# Altium schematic sheet MGD.SCH2.SchDoc
size E
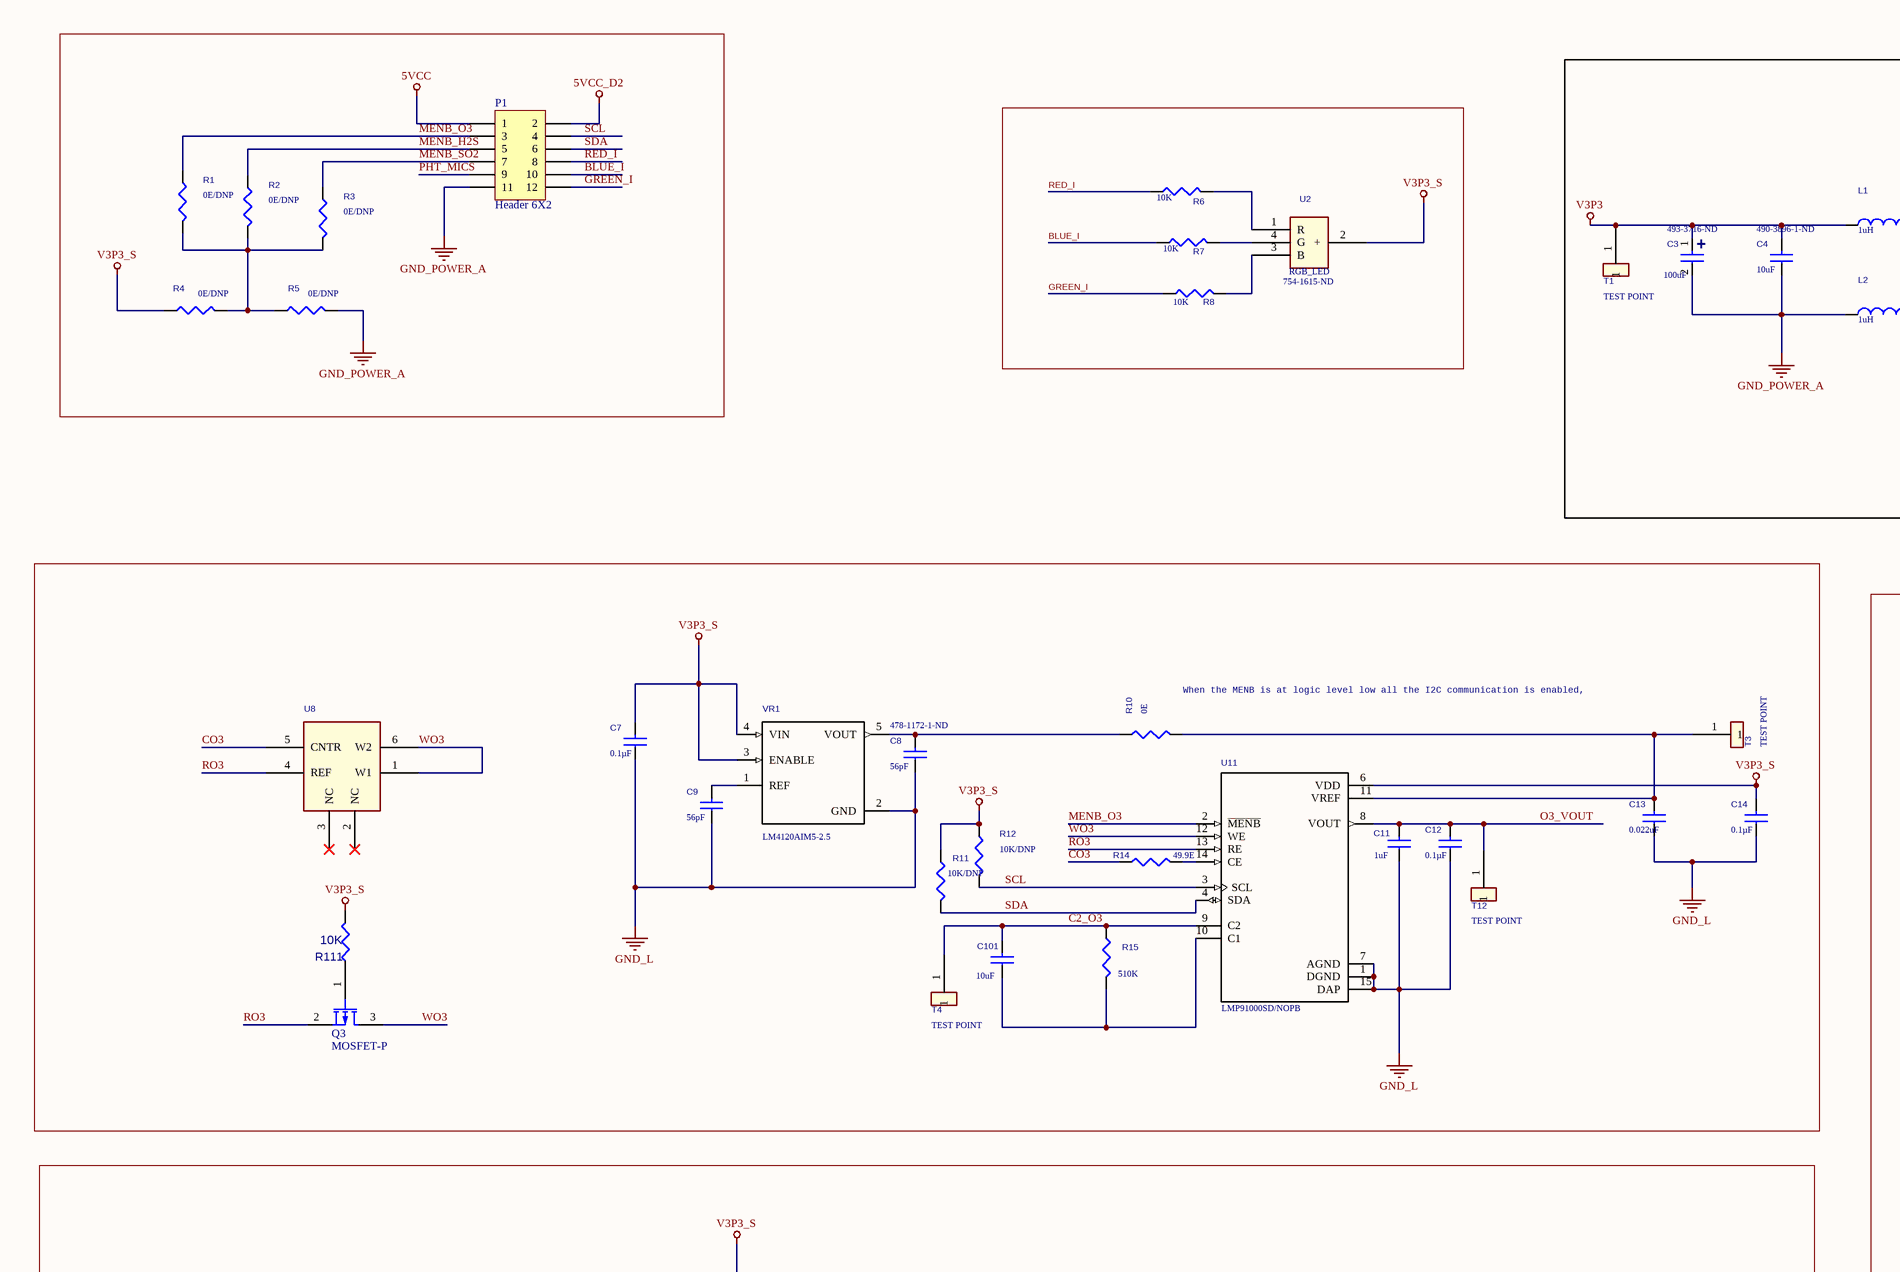
[diagram p0: MGD.SCH2.SchDoc, top left]
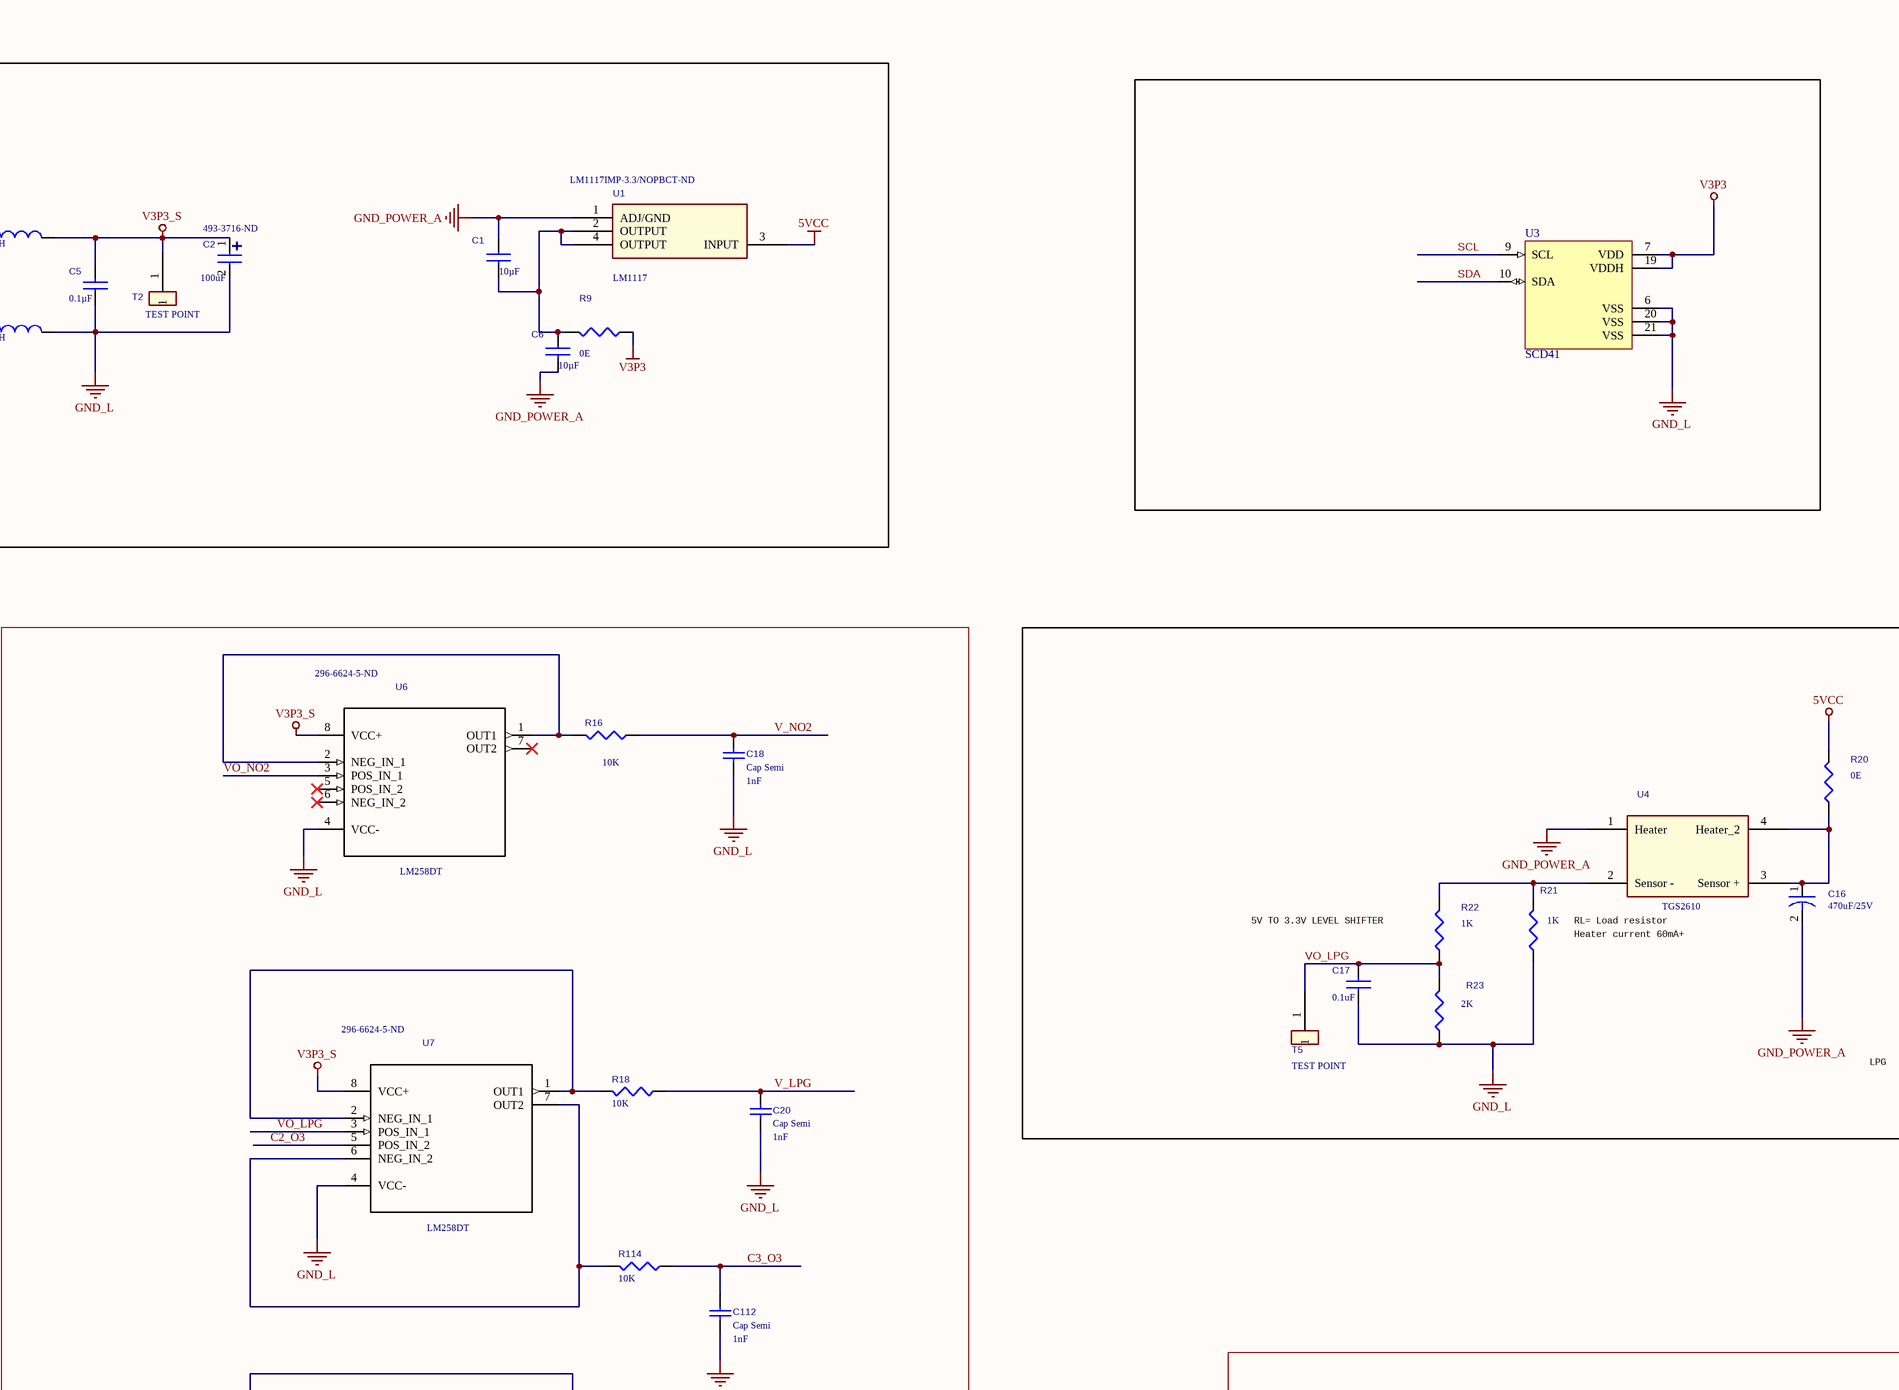
[diagram p1: MGD.SCH2.SchDoc, top middle]
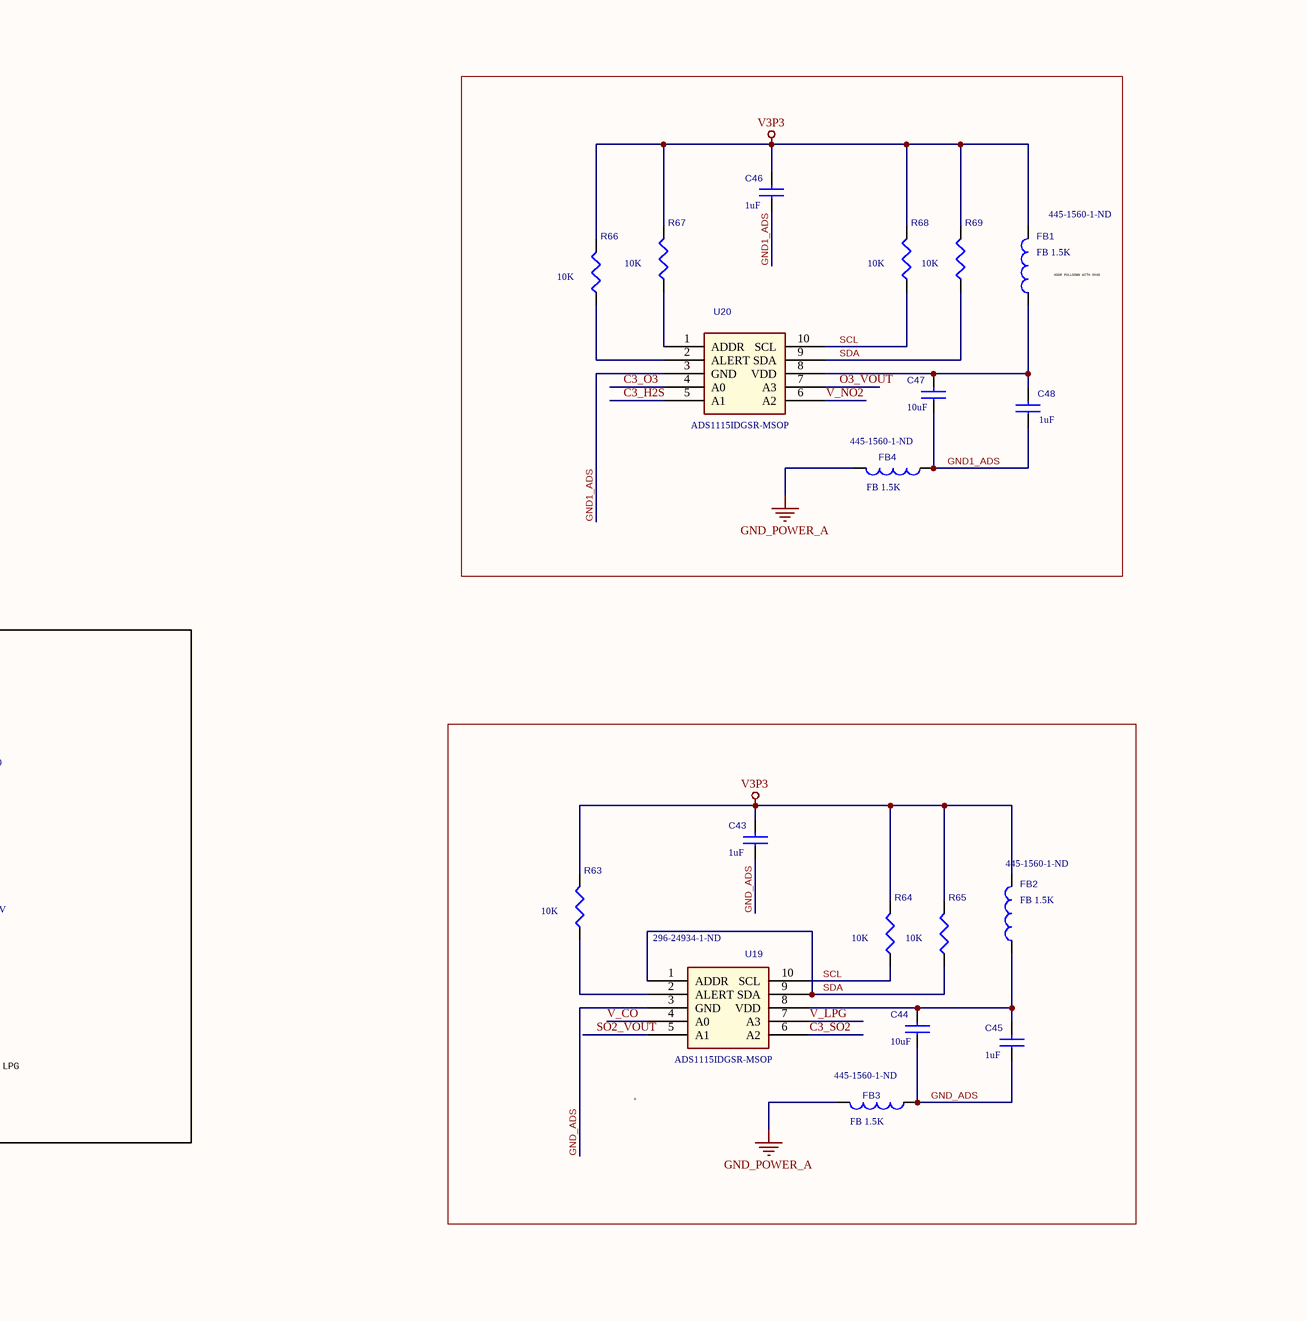
[diagram p2: MGD.SCH2.SchDoc, top right]
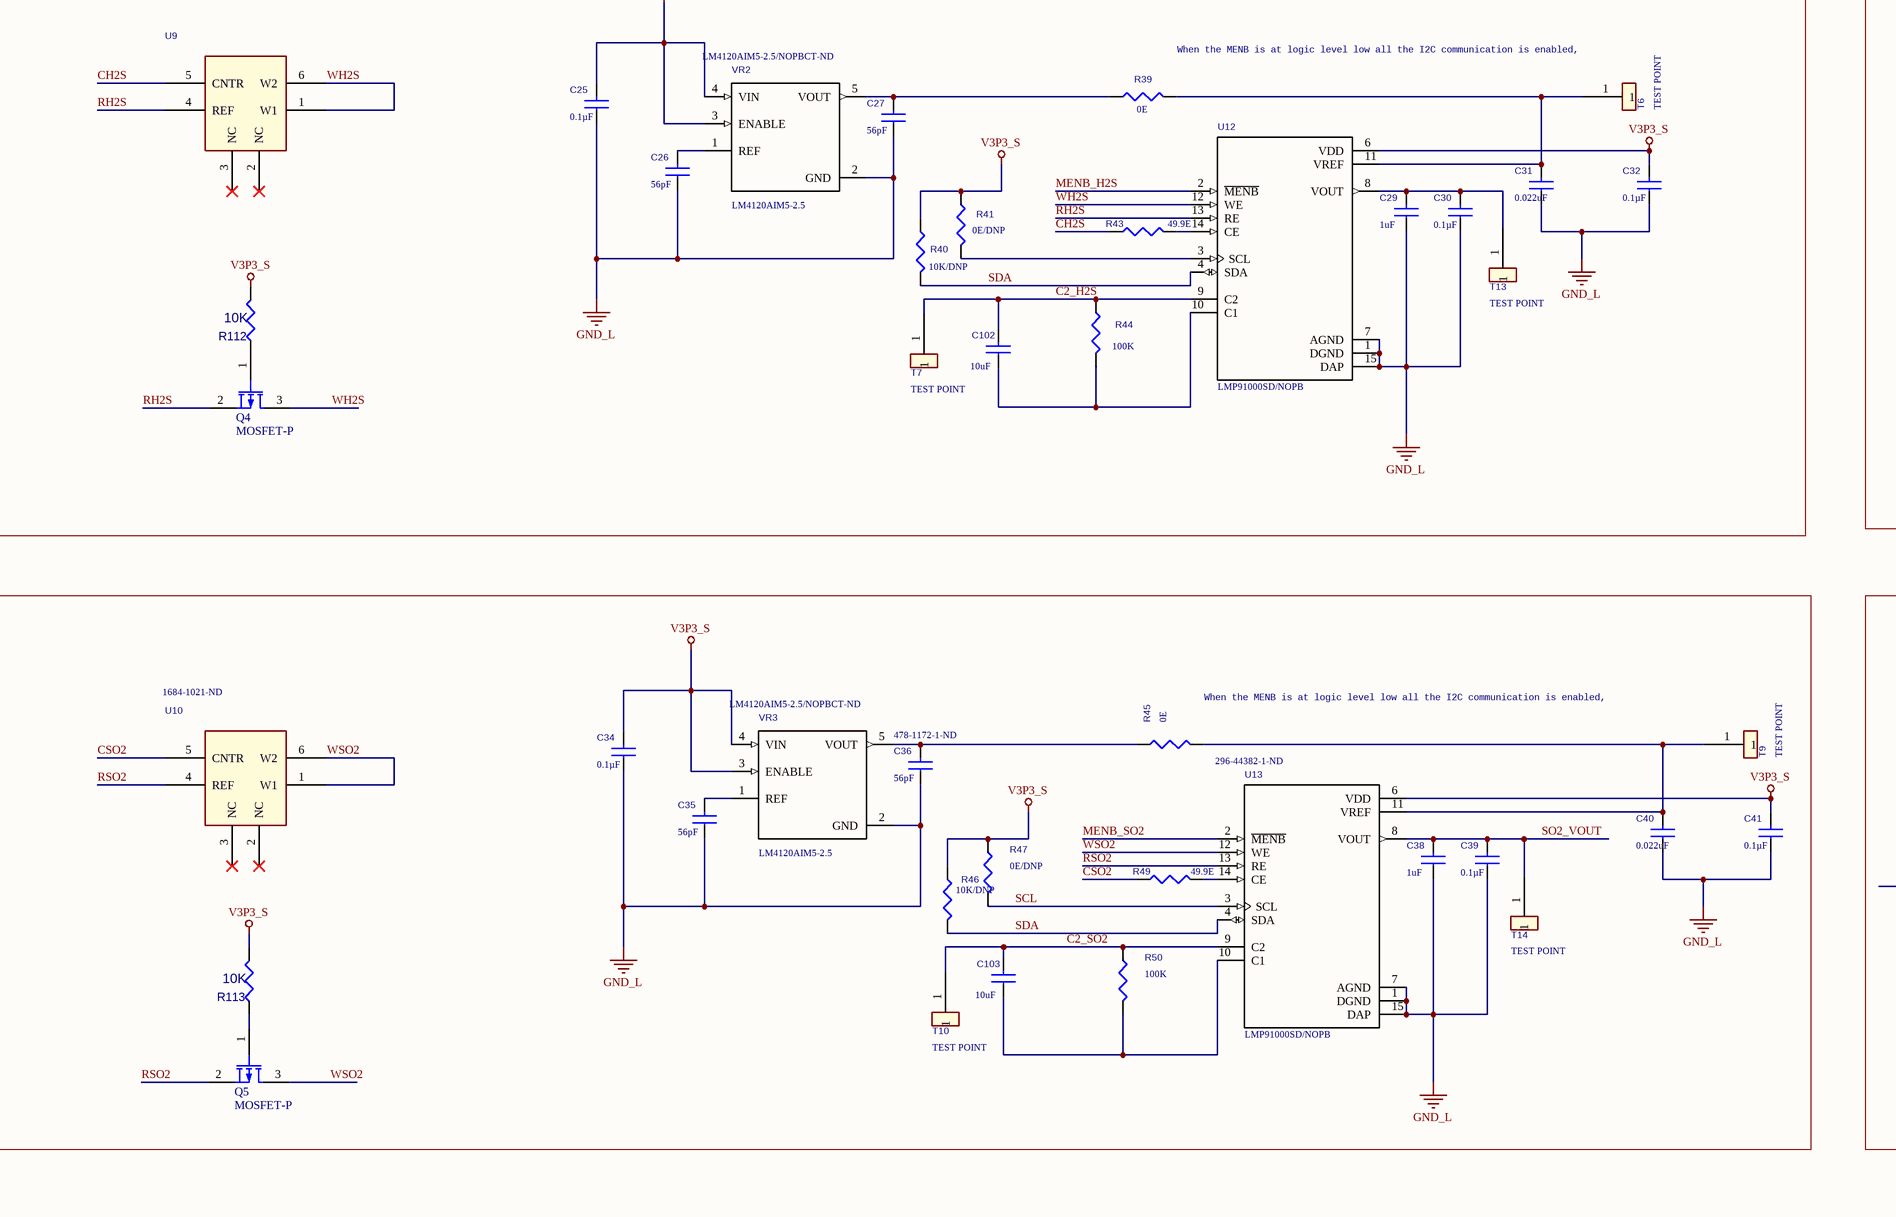
[diagram p3: MGD.SCH2.SchDoc, bottom left]
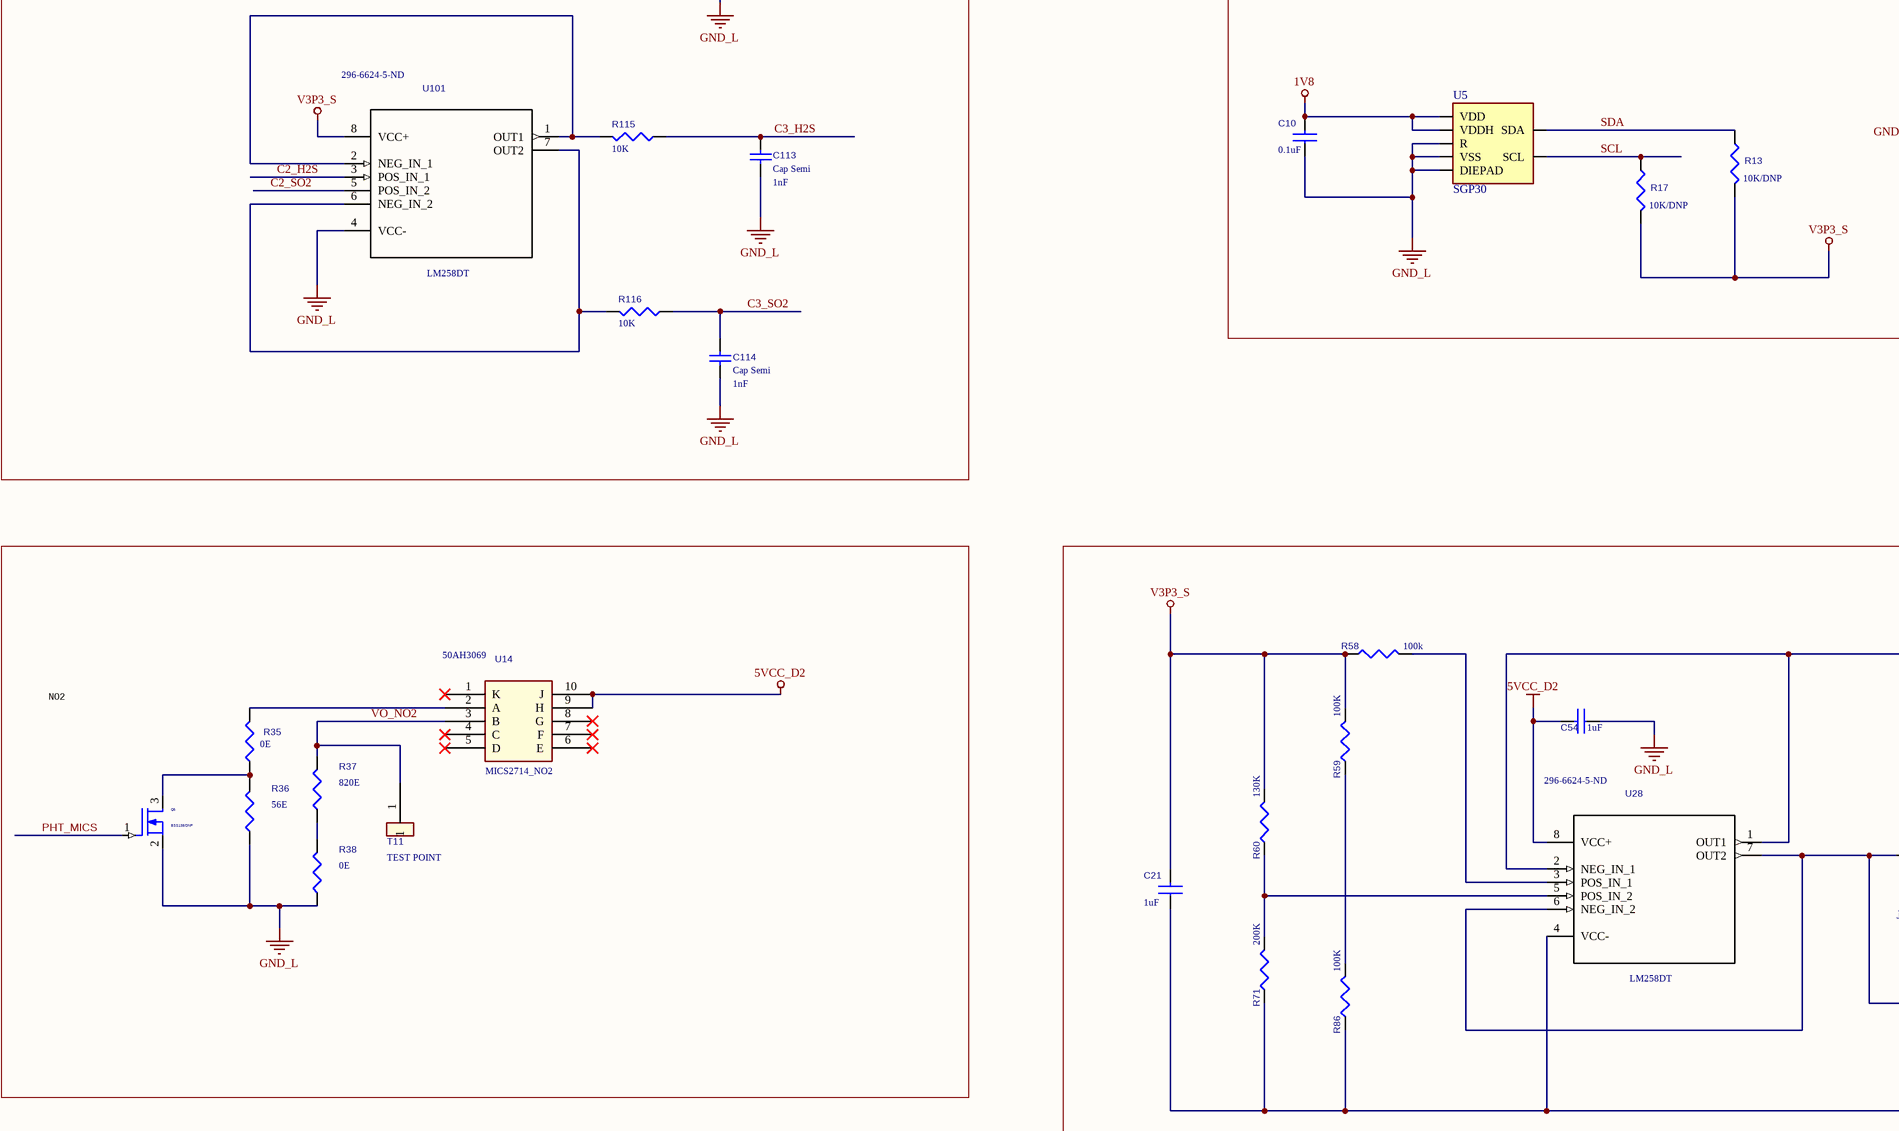
[diagram p4: MGD.SCH2.SchDoc, bottom middle]
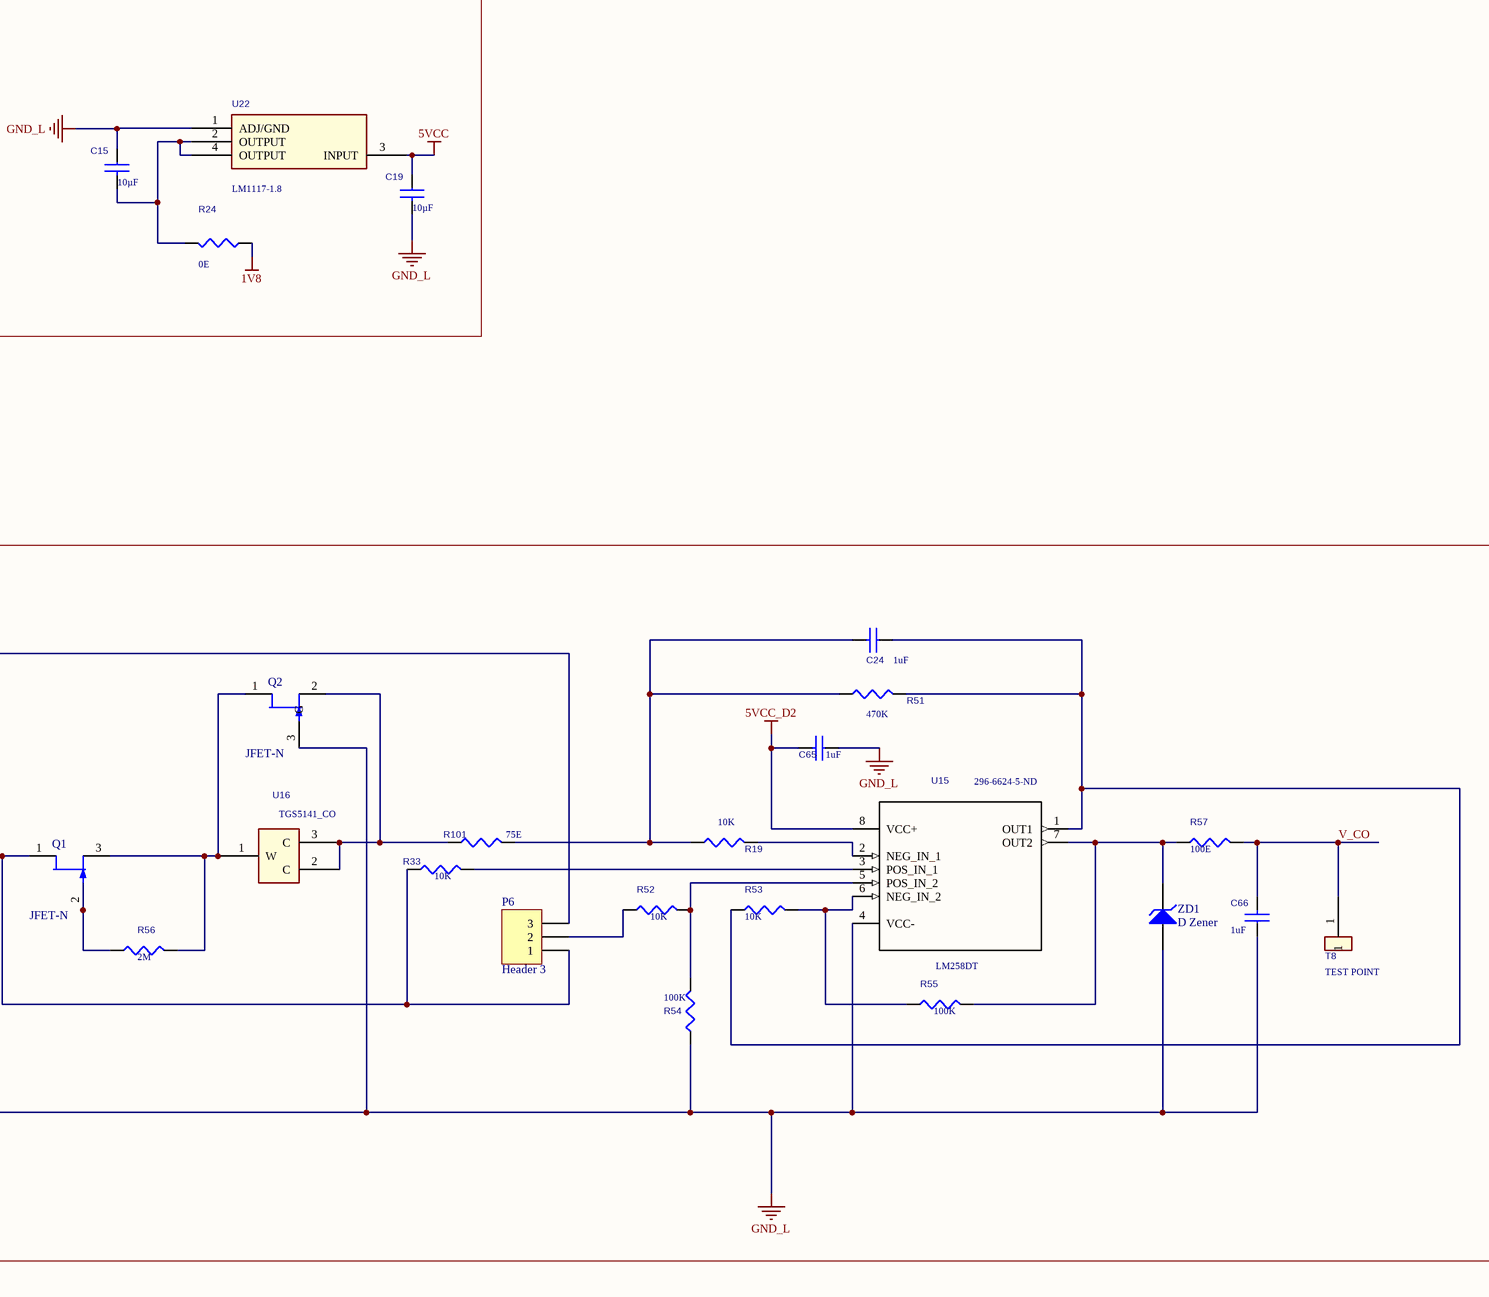
[diagram p5: MGD.SCH2.SchDoc, bottom right]

## Parts
C1  10µF  [C0603]
C2  100uF  Supplier Part Number 1: 493-3716-ND  [C1206]
C3  100uF  Supplier Part Number 1: 493-3716-ND  [C1206]
C4  10uF  Supplier Part Number 1: 490-3896-1-ND  [C0603]
C5  0.1µF  [C0603]
C6  10µF  [C0603]
C7  0.1µF  [C0603]
C8  56pF  Supplier Part Number 1: 478-1172-1-ND  [C0603]
C9  56pF  [C0603]
C10  0.1uF  [C0603]
C11  1uF  [C0603]
C12  0.1µF  [C0603]
C13  0.022uF  [C0603]
C14  0.1µF  [C0603]
C15  10µF  [C0603]
C16  470uF/25V  [C16, C49, C58]
C17  0.1uF  [C0603]
C18  Cap Semi  value 1nF  [C0603]
C19  10µF  [C0603]
C20  Cap Semi  value 1nF  [C0603]
C21  1uF  [C0603]
C24  1uF  [C0603]
C25  0.1µF  [C0603]
C26  56pF  [C0603]
C27  56pF  [C0603]
C29  1uF  [C0603]
C30  0.1µF  [C0603]
C31  0.022uF  [C0603]
C32  0.1µF  [C0603]
C34  0.1µF  [C0603]
C35  56pF  [C0603]
C36  56pF  Supplier Part Number 1: 478-1172-1-ND  [C0603]
C38  1uF  [C0603]
C39  0.1µF  [C0603]
C40  0.022uF  [C0603]
C41  0.1µF  [C0603]
C43  1uF  [C0603]
C44  10uF  [C0603]
C45  1uF  [C0603]
C46  1uF  [C0603]
C47  10uF  [C0603]
C48  1uF  [C0603]
C54  1uF  [C0603]
C65  1uF  [C0603]
C66  1uF  [C0603]
C101  10uF  [C0603]
C102  10uF  [C0603]
C103  10uF  [C0603]
C112  Cap Semi  value 1nF  [C0603]
C113  Cap Semi  value 1nF  [C0603]
C114  Cap Semi  value 1nF  [C0603]
FB1  FB 1.5K  Supplier Part Number 1: 445-1560-1-ND  [FB1, FB2, FB3, FB4]
FB2  FB 1.5K  Supplier Part Number 1: 445-1560-1-ND  [FB1, FB2, FB3, FB4]
FB3  FB 1.5K  Supplier Part Number 1: 445-1560-1-ND  [FB1, FB2, FB3, FB4]
FB4  FB 1.5K  Supplier Part Number 1: 445-1560-1-ND  [FB1, FB2, FB3, FB4]
L1  1uH  [L3, L4, L5, L6, L7]
L2  1uH  [L3, L4, L5, L6, L7]
P1  Header 6X2  [P1,P3_Updated]
P6  Header 3  [P6]
Q1  JFET-N  [Q1-Q2]
Q2  JFET-N  [SOT23F]
Q3  MOSFET-P  [Q3-Q5,Q6]
Q4  MOSFET-P  [Q3-Q5,Q6]
Q5  MOSFET-P  [Q3-Q5,Q6]
Q6  BSS138/DNP  [Q3-Q5,Q6]
R1  0E/DNP  [R0603]
R2  0E/DNP  [R0603]
R3  0E/DNP  [R0603]
R4  0E/DNP  [R0603]
R5  0E/DNP  [R0603]
R6  10K  [R0603]
R7  10K  [R0603]
R8  10K  [R0603]
R9  0E  [R0603]
R10  0E  [R0603]
R11  10K/DNP  [R0603]
R12  10K/DNP  [R0603]
R13  10K/DNP  [R0603]
R14  49.9E  [R0603]
R15  510K  [R0603]
R16  10K  [R0603]
R17  10K/DNP  [R0603]
R18  10K  [R0603]
R19  10K  [R0603]
R20  0E  [R0603]
R21  1K  [R0603]
R22  1K  [R0603]
R23  2K  [R0603]
R24  0E  [R0603]
R33  10K  [R0603]
R35  0E  [R0603]
R36  56E  [R0603]
R37  820E  [R0603]
R38  0E  [R0603]
R39  0E  [R0603]
R40  10K/DNP  [R0603]
R41  0E/DNP  [R0603]
R43  49.9E  [R0603]
R44  100K  [R0603]
R45  0E  [R0603]
R46  10K/DNP  [R0603]
R47  0E/DNP  [R0603]
R49  49.9E  [R0603]
R50  100K  [R0603]
R51  470K  [R0603]
R52  10K  [R0603]
R53  10K  [R0603]
R54  100K  [R0603]
R55  100K  [R0603]
R56  2M  [R0603]
R57  100E  [R0603]
R58  100k  [R0603]
R59  100K  [R0603]
R60  130K  [R0603]
R63  10K  [R0603]
R64  10K  [R0603]
R65  10K  [R0603]
R66  10K  [R0603]
R67  10K  [R0603]
R68  10K  [R0603]
R69  10K  [R0603]
R71  200K  [R0603]
R86  100K  [R0603]
R101  75E  [R0603]
R111  10K  [R0603]
R112  10K  [R0603]
R113  10K  [R0603]
R114  10K  [R0603]
R115  10K  [R0603]
R116  10K  [R0603]
T1  TEST POINT  [TP]
T2  TEST POINT  [TP]
T3  TEST POINT  [TP]
T4  TEST POINT  [TP]
T5  TEST POINT  [TP]
T6  TEST POINT  [TP]
T7  TEST POINT  [TP]
T8  TEST POINT  [TP]
T9  TEST POINT  [TP]
T10  TEST POINT  [TP]
T11  TEST POINT  [TP]
T12  TEST POINT  [TP]
T13  TEST POINT  [TP]
T14  TEST POINT  [TP]
U1  LM1117  Supplier Part Number 1: LM1117IMP-3.3/NOPBCT-ND  [U1, U24              SOT-223]
U2  RGB_LED  Supplier Part Number 1: 754-1615-ND  [U2]
U3  SCD41  [XDCR_SCD41-D-R2]
U4  TGS2610  [U4]
U5  SGP30  [XCDR_SGP40-D-R4]
U6  LM258DT  Supplier Part Number 1: 296-6624-5-ND  [U6, U8                    SOIC-8N]
U7  LM258DT  Supplier Part Number 1: 296-6624-5-ND  [U6, U8                    SOIC-8N]
U8  SPEC_SENS_PTH_SO2  [U3, U7, U11]  (value not drawn)
U9  SPEC_SENS_PTH_SO2  [U3, U7, U11]  (value not drawn)
U10  Supplier Part Number 1: 1684-1021-ND  [U3, U7, U11]  (hidden comment: SPEC_SENS_PTH_SO2)
U11  LMP91000SD/NOPB  [U5, U10, U13]
U12  LMP91000SD/NOPB  [U5, U10, U13]
U13  LMP91000SD/NOPB  Supplier Part Number 1: 296-44382-1-ND  [U5, U10, U13]
U14  MICS2714_NO2  Supplier Part Number 1: 50AH3069  [U12]
U15  LM258DT  Supplier Part Number 1: 296-6624-5-ND  [U6, U8                    SOIC-8N]
U16  TGS5141_CO  [U16]
U19  ADS1115IDGSR-MSOP  Supplier Part Number 1: 296-24934-1-ND  [U19, U20]
U20  ADS1115IDGSR-MSOP  [U19, U20]
U22  LM1117-1.8  [U1, U24              SOT-223]
U28  LM258DT  Supplier Part Number 1: 296-6624-5-ND  [U28]
U101  LM258DT  Supplier Part Number 1: 296-6624-5-ND  [U6, U8                    SOIC-8N]
VR1  LM4120AIM5-2.5  [VR1, VR2, VR3]
VR2  LM4120AIM5-2.5  Supplier Part Number 1: LM4120AIM5-2.5/NOPBCT-ND  [VR1, VR2, VR3]
VR3  LM4120AIM5-2.5  Supplier Part Number 1: LM4120AIM5-2.5/NOPBCT-ND  [VR1, VR2, VR3]
ZD1  D Zener  [ZD1]

## Blocks framed on the sheet
ADDR PULLDOWN WITH 0X48: C46-C48 FB1 FB4 R66-R69 U20
A: C43-C45 FB2 FB3 R63-R65 U19
NO2: Q6 R35-R38 T11 U14

## Nets
1V8: C10.2 R24.1 U5.1(VDD) U5.5(VDDH)
5VCC: C19.1 P1.1 R20.2 U1.3(INPUT) U22.3(INPUT)
5VCC_D2: C54.2 C65.2 P1.2 U14.9(H) U14.10(J) U15.8(VCC+) U28.8(VCC+)
GND_L: C2.2 C5.1 C7.1 C8.1 C9.1 C10.1 C11.1 C12.1 C13.1 C14.1 C15.1 C17.1 C18.1 C19.2 C20.1 C21.1 C25.1 C26.1 C27.1 C29.1 C30.1 C31.1 C32.1 C34.1 C35.1 C36.1 C38.1 C39.1 C40.1 C41.1 C54.1 C65.1 C66.1 C112.1 C113.1 C114.1 L2.2 Q2.3(G) Q6.2(SOURCE) R21.2 R23.1 R36.1 R38.1 R54.1 R71.1 R86.1 U3.6(VSS) U3.20(VSS) U3.21(VSS) U5.2(VSS) U5.4(R) U5.DIEPAD U6.4(VCC-) U7.4(VCC-) U11.1(DGND) U11.7(AGND) U11.15(DAP) U12.1(DGND) U12.7(AGND) U12.15(DAP) U13.1(DGND) U13.7(AGND) U13.15(DAP) U15.4(VCC-) U22.1(ADJ/GND) U28.4(VCC-) U101.4(VCC-) VR1.2(GND) VR2.2(GND) VR3.2(GND) ZD1.1(A)
GND_POWER_A: C1.1 C3.2 C4.1 C6.2 C16.2 FB3.2 FB4.2 L2.1 P1.11 R5.2 U1.1(ADJ/GND) U4.1(Heater)
V3P3: C3.1 C4.2 C43.2 C46.2 FB1.2 FB2.2 L1.1 R9.1 R63.1 R64.1 R65.1 R66.1 R67.1 R68.1 R69.1 T1.1 U3.7(VDD) U3.19(VDDH)
V3P3_S: C2.1 C5.2 C7.2 C14.2 C21.2 C25.2 C32.2 C34.2 C41.2 L1.2 R4.1 R11.1 R12.1 R13.2 R17.2 R40.1 R41.1 R46.1 R47.1 R58.1 R59.2 R60.2 R111.2 R112.2 R113.2 T2.1 U2.2(+) U6.8(VCC+) U7.8(VCC+) U11.6(VDD) U12.6(VDD) U13.6(VDD) U101.8(VCC+) VR1.3(ENABLE) VR1.4(VIN) VR2.3(ENABLE) VR2.4(VIN) VR3.3(ENABLE) VR3.4(VIN)
BLUE_I: P1.10 R7.1
C2_H2S: C102.2 R44.1 T7.1 U12.9(C2) U101.3(POS_IN_1)
C2_O3: C101.2 R15.1 T4.1 U7.5(POS_IN_2) U11.9(C2)
C2_SO2: C103.2 R50.1 T10.1 U13.9(C2) U101.5(POS_IN_2)
C3_H2S: C113.2 R115.1 U20.5(A1)
C3_O3: C112.2 R114.1 U20.4(A0)
C3_SO2: C114.2 R116.1 U19.6(A2)
CH2S: R43.1 U9.5(CNTR)
CO3: R14.1 U8.5(CNTR)
CSO2: R49.1 U10.5(CNTR)
GND1_ADS: C46.1 C47.1 C48.1 FB4.1 U20.3(GND)
GND_ADS: C43.1 C44.1 C45.1 FB3.1 U19.3(GND)
GREEN_I: P1.12 R8.1
MENB_H2S: P1.5 R2.1 U12.2(~{MENB})
MENB_O3: P1.3 R1.1 U11.2(~{MENB})
MENB_SO2: P1.7 R3.1 U13.2(~{MENB})
O3_VOUT: C11.2 C12.2 T12.1 U11.8(VOUT) U20.7(A3)
PHT_MICS: P1.9 Q6.1(GATE)
RED_I: P1.8 R6.1
RH2S: Q4.2(S) U9.4(REF) U12.13(RE)
RO3: Q3.2(S) U8.4(REF) U11.13(RE)
RSO2: Q5.2(S) U10.4(REF) U13.13(RE)
SCL: P1.4 R12.2 R17.1 R47.2 R64.2 R68.2 U3.9(SCL) U5.6(SCL) U11.3(SCL) U13.3(SCL) U19.10(SCL) U20.10(SCL)
SDA: P1.6 R11.2 R13.1 R40.2 R46.2 R65.2 R69.2 U3.10(SDA) U5.3(SDA) U11.4(SDA) U12.4(SDA) U13.4(SDA) U19.1(ADDR) U19.9(SDA) U20.9(SDA)
SO2_VOUT: C38.2 C39.2 T14.1 U13.8(VOUT) U19.5(A1)
V_CO: C66.2 R57.2 T8.1 U19.4(A0)
V_LPG: C20.2 R18.1 U19.7(A3)
V_NO2: C18.2 R16.1 U20.6(A2)
VO_LPG: C17.2 R22.1 R23.2 T5.1 U7.3(POS_IN_1)
VO_NO2: R37.2 T11.1 U6.3(POS_IN_1) U14.3(B)
WH2S: Q4.3(D) U9.1(W1) U9.6(W2) U12.12(WE)
WO3: Q3.3(D) U8.1(W1) U8.6(W2) U11.12(WE)
WSO2: Q5.3(D) U10.1(W1) U10.6(W2) U13.12(WE)
NetC1_2: C1.2 C6.1 R9.2 U1.2(OUTPUT) U1.4(OUTPUT)
NetC8_2: C8.2 R10.1 VR1.5(VOUT)
NetC9_2: C9.2 VR1.1(REF)
NetC13_2: C13.2 R10.2 T3.1 U11.11(VREF)
NetC15_2: C15.2 R24.2 U22.2(OUTPUT) U22.4(OUTPUT)
NetC16_1: C16.1 R20.1 U4.3(Sensor_+) U4.4(Heater_2)
NetC24_1: C24.1 R51.2 R53.1 U15.1(OUT1)
NetC24_2: C24.2 R19.1 R51.1 R101.2
NetC26_2: C26.2 VR2.1(REF)
NetC27_2: C27.2 R39.1 VR2.5(VOUT)
NetC29_2: C29.2 C30.2 T13.1 U12.8(VOUT)
NetC31_2: C31.2 R39.2 T6.1 U12.11(VREF)
NetC35_2: C35.2 VR3.1(REF)
NetC36_2: C36.2 R45.1 VR3.5(VOUT)
NetC40_2: C40.2 R45.2 T9.1 U13.11(VREF)
NetC44_2: C44.2 C45.2 FB2.1 U19.8(VDD)
NetC47_2: C47.2 C48.2 FB1.1 U20.8(VDD)
NetC101_1: C101.1 R15.2 U11.10(C1)
NetC102_1: C102.1 R44.2 U12.10(C1)
NetC103_1: C103.1 R50.2 U13.10(C1)
NetP6_1: P6.1 Q1.1(D) R33.1 U28.6(NEG_IN_2) U28.7(OUT2)
NetP6_2: P6.2 R52.1
NetP6_3: P6.3 U28.1(OUT1) U28.2(NEG_IN_1)
NetQ1_2: Q1.2(G) R56.1
NetQ1_3: Q1.3(S) Q2.1(D) R56.2 U16.1(W)
NetQ2_2: Q2.2(S) R101.1 U16.2(C) U16.3(C)
NetQ3_1: Q3.1(G) R111.1
NetQ4_1: Q4.1(G) R112.1
NetQ5_1: Q5.1(G) R113.1
NetQ6_3: Q6.3(DRAIN) R35.1 R36.2
NetR1_2: R1.2 R2.2 R3.2 R4.2 R5.1
NetR6_2: R6.2 U2.1(R)
NetR7_2: R7.2 U2.4(G)
NetR8_2: R8.2 U2.3(B)
NetR14_2: R14.2 U11.14(CE)
NetR16_2: R16.2 U6.1(OUT1) U6.2(NEG_IN_1)
NetR18_2: R18.2 U7.1(OUT1) U7.2(NEG_IN_1)
NetR19_2: R19.2 U15.2(NEG_IN_1)
NetR21_1: R21.1 R22.2 U4.2(Sensor_-)
NetR33_2: R33.2 U15.3(POS_IN_1)
NetR35_2: R35.2 U14.2(A)
NetR37_1: R37.1 R38.2
NetR41_2: R41.2 U12.3(SCL)
NetR43_2: R43.2 U12.14(CE)
NetR49_2: R49.2 U13.14(CE)
NetR52_2: R52.2 R54.2 U15.5(POS_IN_2)
NetR53_2: R53.2 R55.1 U15.6(NEG_IN_2)
NetR55_2: R55.2 R57.1 U15.7(OUT2) ZD1.2(K)
NetR58_2: R58.2 U28.3(POS_IN_1)
NetR59_1: R59.1 R86.2
NetR60_1: R60.1 R71.2 U28.5(POS_IN_2)
NetR63_2: R63.2 U19.2(ALERT)
NetR66_2: R66.2 U20.2(ALERT)
NetR67_2: R67.2 U20.1(ADDR)
NetR114_2: R114.2 U7.6(NEG_IN_2) U7.7(OUT2)
NetR115_2: R115.2 U101.1(OUT1) U101.2(NEG_IN_1)
NetR116_2: R116.2 U101.6(NEG_IN_2) U101.7(OUT2)

Not connected (* = marked no-connect by the designer): U6 5(POS_IN_2)* 6(NEG_IN_2)* 7(OUT2)*; U8 2(NC)* 3(NC)*; U9 2(NC)* 3(NC)*; U10 2(NC)* 3(NC)*; U14 1(K)* 4(C)* 5(D)* 6(E)* 7(F)* 8(G)*

## Notes on the sheet
- (near C3) +
- (near C2) +
- (near R10) When the MENB is at logic level low all the I2C communication is enabled,
- 5V TO 3.3V LEVEL SHIFTER
- RL= Load resistor
- Heater current 60mA+
- LPG
- (near R39) When the MENB is at logic level low all the I2C communication is enabled,
- (near R45) When the MENB is at logic level low all the I2C communication is enabled,
- Title
- Size:
- Date:
- File:
- E
- Number:
- Time:
- Revision:
- Sheet
- of

## Library data of the parts
C1 C6 C15 C19 = CAP_C_10µF/35V: CAP CER SMD 10µF/35V; Manufacturer: Taiyo Yuden; Manufacturer Part Number: GMK316AB7106KL-TR; Tolerance: ±10%; Voltage - Rated: 35V; Temperature Coefficient: X7R; Supplier 1: Digi-Key; Supplier Part Number 1: 587-3007-1-ND; RoHS: RoHS Compliant; Category: Capacitors; Stock 1: 533940; Pricing 1: 1=0.51, 10=0.362, 25=0.3092, 50=0.274, 100=0.2387, 250=0.20328, 500=0.17678, 1000=0.15026 (USD); Packaging: Cut Tape (CT); Part Status: Active; Capacitance: 10µF; Operating Temperature: -55°C ~ 125°C; Features: -; Ratings: -; Applications: General Purpose; Mounting Type: Surface Mount, MLCC; Package / Case: 1206 (3216 Metric); Size / Dimension: 0.126" L x 0.063" W (3.20mm x 1.60mm); Height - Seated (Max): -; Thickness (Max): 0.071" (1.80mm); Lead Spacing: -; Lead Style: -; ComponentLink1URL: http://www.yuden.co.jp/productdata/catalog/en/mlcc06_e.pdf; ComponentLink1Description: http://www.yuden.co.jp/productdata/catalog/en/mlcc06_e.pdf
C2 C3 = CAP_C_0.1µF/16V: CAP ALUM POLY 100UF 20% 16V T/H; Manufacturer: Murata Electronics North America; Manufacturer Part Number: 490-16313-2-ND; Tolerance: ±10%; Temperature Coefficient: X5R; RoHS: RoHS Compliant; Category: Capacitors; Stock 1: 958509; Pricing 1: 1=0.1, 10=0.062, 25=0.0456, 50=0.034, 100=0.0278, 250=0.02328, 500=0.01988, 1000=0.01562, 5000=0.01307 (USD); Packaging: Cut Tape (CT); Part Status: Active; Capacitance: 100UF; Voltage - Rated: 16V; Operating Temperature: -55°C ~ 85°C; Features: -; Ratings: -; Applications: General Purpose; Mounting Type: Surface Mount, MLCC; Package / Case: Radial, Can; Size / Dimension: 1206; Height - Seated (Max): -; Thickness (Max): 0.022" (0.55mm); Lead Spacing: -; Lead Style: -; ComponentLink1URL: http://www.murata.com/~/media/webrenewal/support/library/catalog/products/capacitor/mlcc/c02e.ashx; ComponentLink1Description: http://www.murata.com/~/media/webrenewal/support/library/catalog/products/capacitor/mlcc/c02e.ashx; Supplier 1: Digi-Key
C4 C11 C13 C29 C31 C38 C40 = CAP_C_0.1µF/16V: CAP CER SMD 0.1µF/16V; Manufacturer: Murata Electronics North America; Manufacturer Part Number: GRM155R61H104KE19D; Capacitance: 0.1µF; Tolerance: ±10%; Voltage - Rated: 16V; Temperature Coefficient: X5R; RoHS: RoHS Compliant; Category: Capacitors; Stock 1: 958509; Pricing 1: 1=0.1, 10=0.062, 25=0.0456, 50=0.034, 100=0.0278, 250=0.02328, 500=0.01988, 1000=0.01562, 5000=0.01307 (USD); Packaging: Cut Tape (CT); Part Status: Active; Operating Temperature: -55°C ~ 85°C; Features: -; Ratings: -; Applications: General Purpose; Mounting Type: Surface Mount, MLCC; Package / Case: 0402 (1005 Metric); Size / Dimension: 0.039" L x 0.020" W (1.00mm x 0.50mm); Height - Seated (Max): -; Thickness (Max): 0.022" (0.55mm); Lead Spacing: -; Lead Style: -; ComponentLink1URL: http://www.murata.com/~/media/webrenewal/support/library/catalog/products/capacitor/mlcc/c02e.ashx; ComponentLink1Description: http://www.murata.com/~/media/webrenewal/support/library/catalog/products/capacitor/mlcc/c02e.ashx; Supplier 1: Digi-Key
  C11 C13 C29 C31 C38 C40: Supplier Part Number 1: 490-11917-1-ND
C5 C7 C12 C14 C25 C30 C32 C34 C39 C41 = CAP_C_0.1µF/16V: CAP CER SMD 0.1µF/16V; Manufacturer: Murata Electronics North America; Manufacturer Part Number: GRM155R61H104KE19D; Tolerance: ±10%; Voltage - Rated: 16V; Temperature Coefficient: X5R; Supplier 1: Digi-Key; RoHS: RoHS Compliant; Category: Capacitors; Stock 1: 958509; Pricing 1: 1=0.1, 10=0.062, 25=0.0456, 50=0.034, 100=0.0278, 250=0.02328, 500=0.01988, 1000=0.01562, 5000=0.01307 (USD); Packaging: Cut Tape (CT); Part Status: Active; Capacitance: 0.1µF; Operating Temperature: -55°C ~ 85°C; Features: -; Ratings: -; Applications: General Purpose; Mounting Type: Surface Mount, MLCC; Package / Case: 0402 (1005 Metric); Size / Dimension: 0.039" L x 0.020" W (1.00mm x 0.50mm); Height - Seated (Max): -; Thickness (Max): 0.022" (0.55mm); Lead Spacing: -; Lead Style: -; ComponentLink1URL: http://www.murata.com/~/media/webrenewal/support/library/catalog/products/capacitor/mlcc/c02e.ashx; ComponentLink1Description: http://www.murata.com/~/media/webrenewal/support/library/catalog/products/capacitor/mlcc/c02e.ashx
  C5 C12 C14 C30 C32 C39 C41: Supplier Part Number 1: 490-11917-1-ND
  C7 C25 C34: Supplier Part Number 1: 311-1088-1-ND
C8 C27 C36 = CAP_C_0.1µF/16V: CAP CER SMD 56pF; Manufacturer: Murata Electronics North America; Manufacturer Part Number: 06035A560JAT2A; Capacitance: 0.1µF; Tolerance: ±10%; Voltage - Rated: 16V; Temperature Coefficient: X5R; RoHS: RoHS Compliant; Category: Capacitors; Stock 1: 958509; Pricing 1: 1=0.1, 10=0.062, 25=0.0456, 50=0.034, 100=0.0278, 250=0.02328, 500=0.01988, 1000=0.01562, 5000=0.01307 (USD); Packaging: Cut Tape (CT); Part Status: Active; Operating Temperature: -55°C ~ 85°C; Features: -; Ratings: -; Applications: General Purpose; Mounting Type: Surface Mount, MLCC; Package / Case: 0402 (1005 Metric); Size / Dimension: 0.039" L x 0.020" W (1.00mm x 0.50mm); Height - Seated (Max): -; Thickness (Max): 0.022" (0.55mm); Lead Spacing: -; Lead Style: -; ComponentLink1URL: http://www.murata.com/~/media/webrenewal/support/library/catalog/products/capacitor/mlcc/c02e.ashx; ComponentLink1Description: http://www.murata.com/~/media/webrenewal/support/library/catalog/products/capacitor/mlcc/c02e.ashx; Supplier 1: Digi-Key
  C27: Supplier Part Number 1: 478-1172-1-ND
C9 C26 C35 = CAP_C_0.1µF/16V: CAP CER SMD 56pF; Manufacturer: Murata Electronics North America; Manufacturer Part Number: GRM155R61H104KE19D; Capacitance: 0.1µF; Tolerance: ±10%; Voltage - Rated: 16V; Temperature Coefficient: X5R; Supplier 1: Digi-Key; Supplier Part Number 1: 490-11917-1-ND; RoHS: RoHS Compliant; Category: Capacitors; Stock 1: 958509; Pricing 1: 1=0.1, 10=0.062, 25=0.0456, 50=0.034, 100=0.0278, 250=0.02328, 500=0.01988, 1000=0.01562, 5000=0.01307 (USD); Packaging: Cut Tape (CT); Part Status: Active; Operating Temperature: -55°C ~ 85°C; Features: -; Ratings: -; Applications: General Purpose; Mounting Type: Surface Mount, MLCC; Package / Case: 0402 (1005 Metric); Size / Dimension: 0.039" L x 0.020" W (1.00mm x 0.50mm); Height - Seated (Max): -; Thickness (Max): 0.022" (0.55mm); Lead Spacing: -; Lead Style: -; ComponentLink1URL: http://www.murata.com/~/media/webrenewal/support/library/catalog/products/capacitor/mlcc/c02e.ashx; ComponentLink1Description: http://www.murata.com/~/media/webrenewal/support/library/catalog/products/capacitor/mlcc/c02e.ashx
C10 C17 C21 C24 C43-C48 C54 C65 C66 = CAP_C_0.1µF/16V: CAP CER SMD 0.1µF/16V; Manufacturer: Murata Electronics North America; Manufacturer Part Number: GRM155R61H104KE19D; Capacitance: 1nF; Tolerance: ±10%; Voltage - Rated: 16V; Temperature Coefficient: X5R; Supplier 1: Digi-Key; Supplier Part Number 1: 490-11917-1-ND; RoHS: RoHS Compliant; Category: Capacitors; Stock 1: 958509; Pricing 1: 1=0.1, 10=0.062, 25=0.0456, 50=0.034, 100=0.0278, 250=0.02328, 500=0.01988, 1000=0.01562, 5000=0.01307 (USD); Packaging: Cut Tape (CT); Part Status: Active; Operating Temperature: -55°C ~ 85°C; Features: -; Ratings: -; Applications: General Purpose; Mounting Type: Surface Mount, MLCC; Size / Dimension: 0.039" L x 0.020" W (1.00mm x 0.50mm); Height - Seated (Max): -; Thickness (Max): 0.022" (0.55mm); Lead Spacing: -; Lead Style: -; ComponentLink1URL: http://www.murata.com/~/media/webrenewal/support/library/catalog/products/capacitor/mlcc/c02e.ashx; ComponentLink1Description: http://www.murata.com/~/media/webrenewal/support/library/catalog/products/capacitor/mlcc/c02e.ashx
C16 = CAP: CAP ALUM 470UF 20% 50V RADIAL; Part Number: 871-B41896E6477M000
C18 C20 C112-C114 = Cap Semi: Capacitor (Semiconductor SIM Model); Published: 8-Jun-2000; LatestRevisionDate: 29-May-2009; LatestRevisionNote: IPC-7351 Footprint Added.; PackageReference: C1206; Publisher: Altium Limited; PackageDescription: Chip Capacitor
C101-C103 = CAP_C_0.1µF/16V: CAP CER SMD 10uF; Capacitance: 0.1µF; Tolerance: ±10%; Temperature Coefficient: X5R; RoHS: RoHS Compliant; Category: Capacitors; Pricing 1: 1=0.1, 10=0.062, 25=0.0456, 50=0.034, 100=0.0278, 250=0.02328, 500=0.01988, 1000=0.01562, 5000=0.01307 (USD); Packaging: Cut Tape (CT); Part Status: Active; Operating Temperature: -55°C ~ 85°C; Features: -; Ratings: -; Applications: General Purpose; Mounting Type: Surface Mount, MLCC; Package / Case: 0603; Height - Seated (Max): -; Thickness (Max): 0.022" (0.55mm); Lead Spacing: -; Lead Style: -; ComponentLink1URL: http://www.murata.com/~/media/webrenewal/support/library/catalog/products/capacitor/mlcc/c02e.ashx; ComponentLink1Description: http://www.murata.com/~/media/webrenewal/support/library/catalog/products/capacitor/mlcc/c02e.ashx
FB1-FB4 = INDUCTOR_Dup1: Ferrite Beads 1.5K OHM 25%; Part Number: MMZ2012Y152B; Distributor Part Number: MMZ2012Y152B; Manufacturer Part Number: MMZ2012Y152B; Type: Ferrite; Package: 0603; Supplier 1: Digi-Key
L1 L2 = INDUCTOR: FERRITE BEAD 120 OHM 0603 1LN; Part Number: 490-3996-1-ND; Supplier 1: Arrow; Supplier Part Number 1: BLM18SG121TN1D
P1 = Header 6X2: Header, 6-Pin, Dual row; LatestRevisionDate: 17-Jul-2002; LatestRevisionNote: Re-released for DXP Platform.; Publisher: Altium Limited
P6 = Header 3: Header, 3-Pin; LatestRevisionDate: 17-Jul-2002; LatestRevisionNote: Re-released for DXP Platform.; Publisher: Altium Limited
Q1 Q2 = JFET-N: N-Channel JFET; Published: 8-Jun-2000; LatestRevisionDate: 17-Jul-2002; LatestRevisionNote: Re-released for DXP Platform.; PackageReference: TO-254-AA; Publisher: Altium Limited; Code_JEDEC: TO-254-AA
Q3-Q5 = MOSFET-P: P-Channel MOSFET; Published: 8-Jun-2000; LatestRevisionDate: 17-Jul-2002; LatestRevisionNote: Re-released for DXP Platform.; PackageVersion: 1995/1996; PackageReference: E3; Publisher: Altium Limited; PackageDescription: TO, Flat Index; 3 In-Line, Axial Leads; Body Dia. 4.6mm; Lead Dia. 0.5 mm (max)
Q6 = MOSFET N: MOSFET N-CH 50V 220MA SOT-23; Part Number: BSS138CT-ND
R1-R5 R10 R13 R15 R17 R39-R41 R45-R47 R111-R113 = R: RES SMD 4.7K OHM 1% 1/16W 0603; Part Number: RR08P4.7KDTR-ND; Package: 0603; Type: Resistor
R6-R8 = R: RES SMD 4.7K OHM 1% 1/16W 0603; Part Number: 311-10KGRTR-ND; Package: 0603; Type: Resistor
R9 R24 = R: RES SMD 470 OHM 1% 1/10W 0603; Part Number: 311-470HRCT-ND; Type: Resistor; Package: 0603
R11 R12 = R: RES SMD 10K OHM 1% 1/16W 0603; Part Number: RR08P4.7KDTR-ND; Package: 0603; Type: Resistor
R14 R19 R33 R43 R49 R51-R60 R71 R86 R101 = R: RES SMD 49.9 OHM 1% 1/16W 0603; Part Number: RR08P4.7KDTR-ND; Package: 0603; Type: Resistor
R16 R18 R114-R116 = Res3: RES SMD 10K OHM 1% 1/16W 0603; Published: 8-Jun-2000; LatestRevisionDate: 29-May-2009; LatestRevisionNote: IPC-7351 Footprint Added.; PackageReference: J1-0603; Publisher: Altium Limited; PackageDescription: Chip Resistor
R20 = R: RES SMD 0E OHM 5% 1/10W 0603; Package: 0603; Type: Resistor
R21 = R: RES SMD 1K OHM 5% 1/10W 0603; Part Number: 311-1.0KGRTR-ND; Manufacturer Part Number: 1276-3466-2-ND; Manufacturer: Samsung; Rating: 1/16W; Tolerance: 1%; Type: Resistor; Distributor: Digikey; Distributor Part Number: 1276-3466-2-ND; Package: 0603
R22 R36-R38 = R: RES SMD 1K OHM 5% 1/10W 0603; Part Number: 311-1.0KGRTR-ND; Type: Resistor; Package: 0603
R23 = R: RES SMD 2K OHM 1% 1/10W 0603; Part Number: YAG1297CT-ND; Package: 0603; Type: Resistor
R35 = R: RES SMD 1K OHM 5% 1/10W 0603; Part Number: RNCP0603FTD75R0TR-ND; Type: Resistor; Package: 0603
R44 = R: Type: Resistor
R50 = R: RES SMD; Type: Resistor
R63-R65 = R: RES SMD 4.7K OHM 1% 1/16W 0603; Manufacturer Part Number: 1276-3466-2-ND; Manufacturer: Samsung; Part Number: P4.7KBDCT-ND; Type: Resistor; Rating: 1/16W; Tolerance: 1%; Distributor: Digikey; Distributor Part Number: 1276-3466-2-ND; Package: 0603
R66-R69 = R: RES SMD 4.7K OHM 1% 1/16W 0603; Manufacturer Part Number: 1276-3466-2-ND; Manufacturer: Samsung; Part Number: P4.7KDBCT-ND; Type: Resistor; Rating: 1/16W; Tolerance: 1%; Distributor: Digikey; Distributor Part Number: 1276-3466-2-ND; Package: 0603
T1-T14 = Test_P
U1 = TLV70033DDCT: 3.3V LDO; Manufacturer: Texas Instruments; Regulator Topology: Positive Fixed; Current - Output: 200mA; Voltage - Input: Up to 5.5V; Current - Limit (Min): 220mA; Manufacturer Part Number: LM1117; RoHS: RoHS Compliant; Category: Integrated Circuits (ICs); Stock 1: 5021; Pricing 1: 1=0.53, 10=0.452, 100=0.3374 (USD); Packaging: Cut Tape (CT); Part Status: Active; Voltage - Output: 3.3V; Voltage - Dropout (Typical): -; Operating Temperature: -40°C ~ 125°C; Mounting Type: Surface Mount; Package / Case: SOT-23-5 Thin, TSOT-23-5; Supplier Device Package: SOT-23-5; ComponentLink1URL: http://www.ti.com/lit/ds/slvsa00e/slvsa00e.pdf; ComponentLink1Description: http://www.ti.com/lit/ds/slvsa00e/slvsa00e.pdf; Supplier 1: Digi-Key
U2 = RGB_LED_PTH_0: Part Number: 754-1492-ND; Supplier 1: Digi-Key
U3 = SCD4x
U4 = TGS2602_1: Part Number: TGS2602; Supplier 1: RSComponents; Supplier Part Number 1: 1346640
U5 = SGP30: AIR QUALITY GAS SENSOR FOR VOC'S; MF: Sensirion AG; Value: *; Availability: Unavailable; Price: None; Check_prices: https://www.snapeda.com/parts/SGP30/Sensirion%20AG/view-part/1413307/?ref=eda; SnapEDA_Link: https://www.snapeda.com/parts/SGP30/Sensirion%20AG/view-part/1413307/?ref=snap; Package: None; MP: SGP30
U6 U7 U15 U28 U101 = LM258DT: LM258 Series 30 V 1.1 MHz Low Power Dual Operational Amplifier - SOIC-8; MF: Texas Instruments; MP: LM258D; Price: None; Availability: Unavailable; SnapEDA_Link: https://www.snapeda.com/parts/LM258D/Texas%20Instruments/view-part/588352/?ref=snap; Package: SOIC-8 STMicroelectronics; Value: *; Supplier 1: Digi-Key
U8 U9 = Spec_figaro_pth_0: SENS GAS SULF DIOX ANALG CUR MOD; part number: 1684-1042-ND; Supplier 1: Digi-Key
  U8: Supplier Part Number 1: 1684-1042-ND
  U9: Supplier Part Number 1: 1684-1009-ND
U10 = Spec_figaro_pth_0: SENS GAS SULF DIOX ANALG CUR MOD; Supplier 1: Digi-Key
U11-U13 = LMP91000SD/NOPB: 1 Channel AFE 8 Bit 14-WSON _4x4_; MF: Texas Instruments; Availability: Unavailable; Price: None; Package: WFDFN-14 Texas Instruments; MP: LMP91000SD/NOPB; SnapEDA_Link: https://www.snapeda.com/parts/LMP91000SD/NOPB/Texas%20Instruments/view-part/547082/?ref=snap; Value: *
  U13: Supplier 1: Digi-Key
U14 = MICS6814_0: Supplier 1: Newark
U16 = TGS5141: part number: TGS5141-P00
U19 U20 = ADS1115: IC ADC 16BIT SIGMA-DELTA 10VSSOP; Part Number: 595-ADS1115IDGST; Supplier 1: Digi-Key
  U20: Supplier Part Number 1: 296-24934-1-ND
U22 = TLV70033DDCT: 3.3V LDO; Manufacturer: Texas Instruments; Manufacturer Part Number: LM1117; Regulator Topology: Positive Fixed; Current - Output: 200mA; Voltage - Input: Up to 5.5V; Current - Limit (Min): 220mA; RoHS: RoHS Compliant; Category: Integrated Circuits (ICs); Stock 1: 5021; Pricing 1: 1=0.53, 10=0.452, 100=0.3374 (USD); Packaging: Cut Tape (CT); Part Status: Active; Voltage - Output: 3.3V; Voltage - Dropout (Typical): -; Operating Temperature: -40°C ~ 125°C; Mounting Type: Surface Mount; Package / Case: SOT-23-5 Thin, TSOT-23-5; Supplier Device Package: SOT-23-5; ComponentLink1URL: http://www.ti.com/lit/ds/slvsa00e/slvsa00e.pdf; ComponentLink1Description: http://www.ti.com/lit/ds/slvsa00e/slvsa00e.pdf; Supplier 1: Digi-Key; Supplier Part Number 1: LM1117IMP-3.3/NOPBCT-ND
VR1-VR3 = LM4120AIM5-2.5: Precision Micropower Low Dropout Voltage Reference 5-SOT-23 -40 to 85; MF: Texas Instruments; SnapEDA_Link: https://www.snapeda.com/parts/LM4120AIM5-2.5/Texas%20Instruments/view-part/30670/?ref=snap; Price: None; Availability: Unavailable; Package: SOT-23 Texas Instruments; MP: LM4120AIM5-2.5; Value: *; Supplier 1: Digi-Key
  VR1: Supplier Part Number 1: LM4120AIM5-2.5/NOPBCT-ND
ZD1 = D Zener: Zener Diode; Published: 8-Jun-2000; LatestRevisionDate: 17-Jul-2002; LatestRevisionNote: Re-released for DXP Platform.; PackageReference: DIODE-0.7; Publisher: Altium Limited; PackageDescription: Diode, Thru-Hole; 2 Leads; 0.7 in Pin Spacing